# Altium schematic sheet TYPK.SchDoc
size A3; SheetNumber: 5; SheetTotal: 5
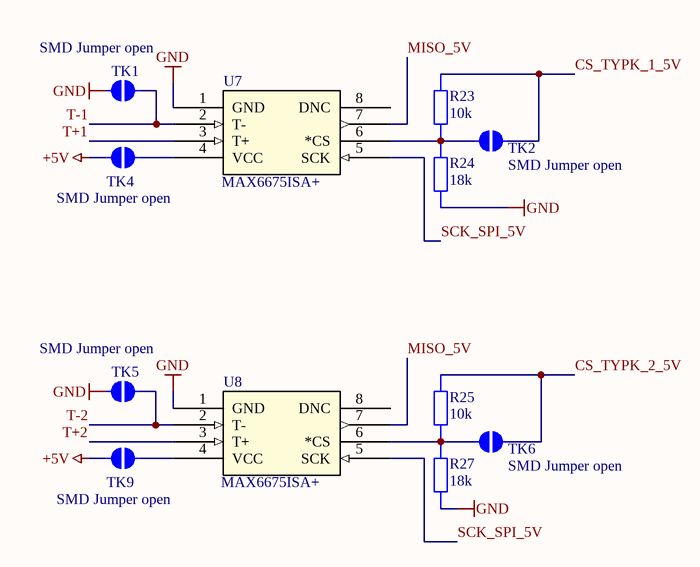
[diagram p0: TYPK.SchDoc]

## Parts
R23  value 10k  [STACKPOLE CSR0603]  (hidden comment: SMD Resistor)
R24  value 18k  [STACKPOLE CSR0603]  (hidden comment: SMD Resistor)
R25  value 10k  [STACKPOLE CSR0603]  (hidden comment: SMD Resistor)
R27  value 18k  [STACKPOLE CSR0603]  (hidden comment: SMD Resistor)
TK1  SMD Jumper open  [SMD-JUMPER-OPEN]  (no BOM)
TK2  SMD Jumper open  [SMD-JUMPER-OPEN]  (no BOM)
TK4  SMD Jumper open  [SMD-JUMPER-OPEN]  (no BOM)
TK5  SMD Jumper open  [SMD-JUMPER-OPEN]  (no BOM)
TK6  SMD Jumper open  [SMD-JUMPER-OPEN]  (no BOM)
TK9  SMD Jumper open  [SMD-JUMPER-OPEN]  (no BOM)
U7  MAX6675ISA+  [SOIC8]
U8  MAX6675ISA+  [SOIC8]

## Nets
+5V: TK4.1 TK9.1
GND: R24.1 R27.1 TK1.1 TK5.1 U7.1(GND) U8.1(GND)
CS_TYPK_1_5V: R23.2 TK2.2
CS_TYPK_2_5V: R25.2 TK6.2
MISO_5V: U7.7(SO) U8.7(SO)
SCK_SPI_5V: U7.5(SCK) U8.5(SCK)
T+1: U7.3(T+)
T+2: U8.3(T+)
T-1: TK1.2 U7.2(T-)
T-2: TK5.2 U8.2(T-)
NetR23_1: R23.1 R24.2 TK2.1 U7.6(*CS)
NetR25_1: R25.1 R27.2 TK6.1 U8.6(*CS)
NetTK4_2: TK4.2 U7.4(VCC)
NetTK9_2: TK9.2 U8.4(VCC)

Not connected (* = marked no-connect by the designer): U7 8(DNC); U8 8(DNC)

## Library data of the parts
R23-R25 R27 = SMD Resistor: Resistor with multiple footprints
U7 U8 = MAX31855KASA+: No Description Available; Vendor: Maxim Integrated Products; Built_By: EMA_UL_Team; Manufacturer_Part_Number: MAX31855KASA+; Copyright: Copyright (C) 2018 Accelerated Designs. All rights reserved; RefDes: RefDes; Type: DEV; Value: Value